# Altium schematic sheet Buck_Converters.SchDoc
size A
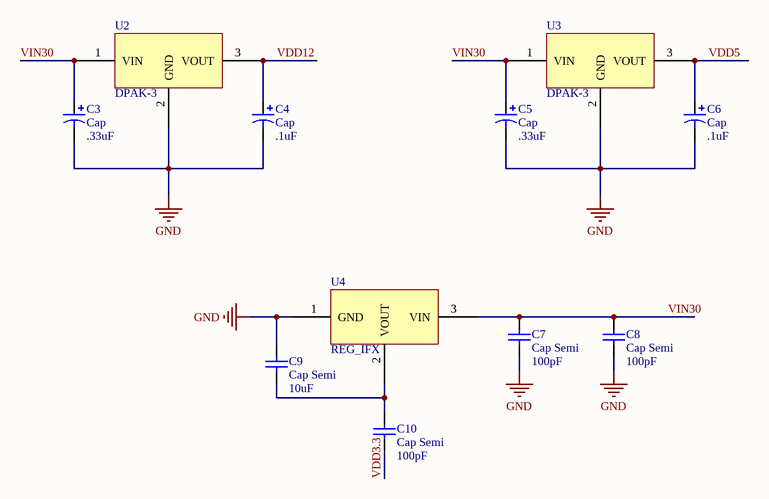
[diagram p0: Buck_Converters.SchDoc]

## Parts
C3  Cap  value .33uF  [C0805]
C4  Cap  value .1uF  [C0805]
C5  Cap  value .33uF  [C0805]
C6  Cap  value .1uF  [C0805]
C7  Cap Semi  value 100pF  [C1206]
C8  Cap Semi  value 100pF  [C1206]
C9  Cap Semi  value 10uF  [C1206]
C10  Cap Semi  value 100pF  [C1206]
U2  DPAK-3  [DPAK-3]
U3  DPAK-3  [DPAK-3]
U4  REG_IFX  [Reg_IFX]

## Nets
GND: C3.2 C4.2 C5.2 C6.2 C7.1 C8.1 C9.2 U2.2(GND) U3.2(GND) U4.1(GND)
VDD3.3: C10.1
VDD5: C6.1 U3.3(VOUT)
VDD12: C4.1 U2.3(VOUT)
VIN30: C3.1 C5.1 C7.2 C8.2 U2.1(VIN) U3.1(VIN) U4.3(VIN)
NetC9_1: C9.1 C10.2 U4.2(VOUT)

## Library data of the parts
C3-C6 = Cap Pol3: Polarized Capacitor (Surface Mount); Published: 8-Jun-2000; LatestRevisionDate: 29-May-2009; LatestRevisionNote: IPC-7351 Footprint Added.; PackageReference: C0805; Publisher: Altium Limited; PackageDescription: Chip Capacitor
C7-C10 = Cap Semi: Capacitor (Semiconductor SIM Model); Published: 8-Jun-2000; LatestRevisionDate: 29-May-2009; LatestRevisionNote: IPC-7351 Footprint Added.; PackageReference: C1206; Publisher: Altium Limited; PackageDescription: Chip Capacitor